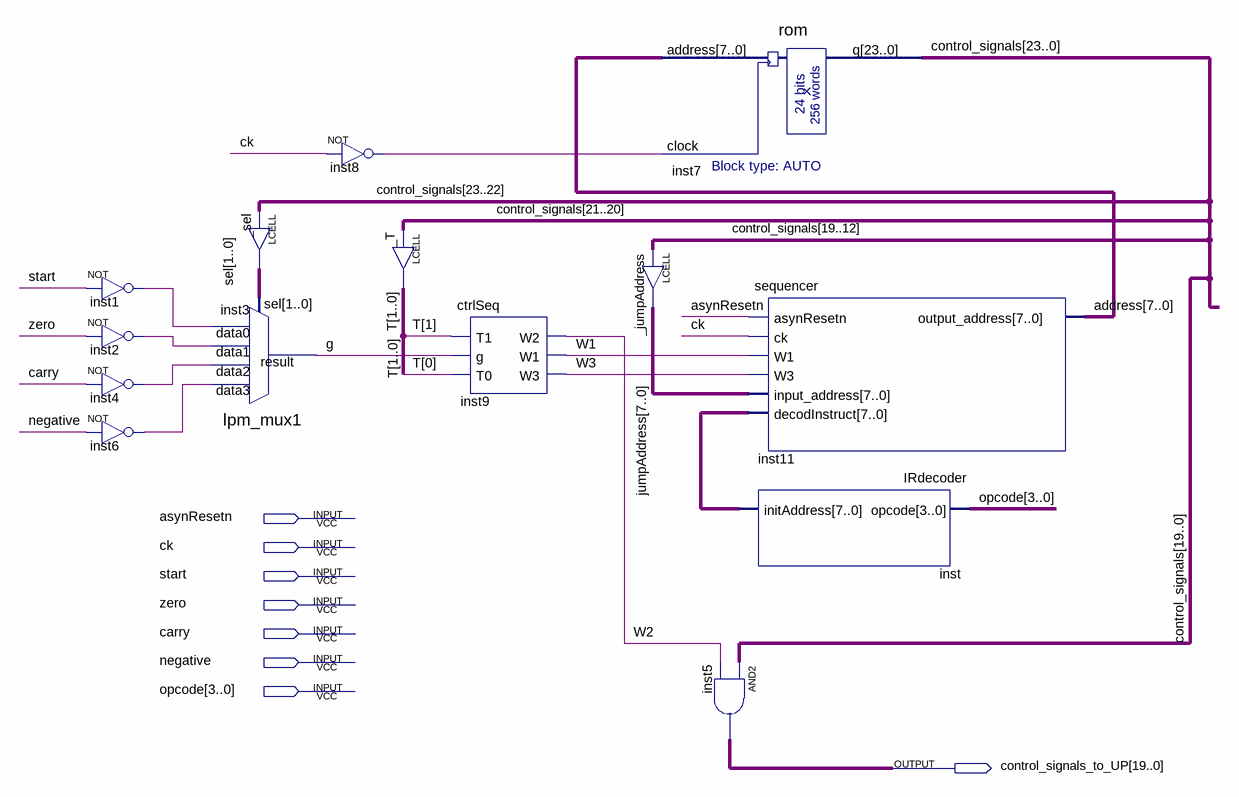
[diagram p0: schematic sheet]
// Quartus schematic UC.bdf as structural Verilog: 14 symbols, 8 pins
module UC (
  input  asynResetn,
  input  ck,
  input  start,
  input  zero,
  input  carry,
  input  negative,
  input  [3:0] opcode,
  output [19:0] control_signals_to_UP
);

  wire g, inst1_out, inst2_out, inst4_out, inst6_out, inst8_out, W1, W2, W3;
  wire [1:0] sel, T;
  wire [7:0] address, inst_initaddress, jumpAddress;
  wire [23:0] control_signals;

  not inst1 (inst1_out, start);
  not inst2 (inst2_out, zero);
  not inst4 (inst4_out, carry);
  not inst6 (inst6_out, negative);
  lpm_mux1 inst3 (.data3(inst6_out), .data2(inst4_out), .data1(inst2_out), .data0(inst1_out), .sel(sel), .result(g));
  LCELL _sel[1:0] (.IN(control_signals[23:22]), .OUT(sel));
  not inst8 (inst8_out, ck);
  LCELL _T[1:0] (.IN(control_signals[21:20]), .OUT(T));
  ctrlSeq inst9 (.T1(T[1]), .g(g), .T0(T[0]), .W2(W2), .W1(W1), .W3(W3));
  rom inst7 (.address(address), .clock(inst8_out), .q(control_signals));
  LCELL _jumpAddress[7:0] (.IN(control_signals[19:12]), .OUT(jumpAddress));
  sequencer inst11 (
    .asynResetn(asynResetn), .ck(ck), .W1(W1), .W3(W3), .input_address(jumpAddress),
    .decodInstruct(inst_initaddress), .output_address(address));
  IRdecoder inst (.opcode(opcode), .initAddress(inst_initaddress));
  assign control_signals_to_UP = control_signals[19:0] & {20{W2}};  // AND2 inst5, 20 bits wide
endmodule
